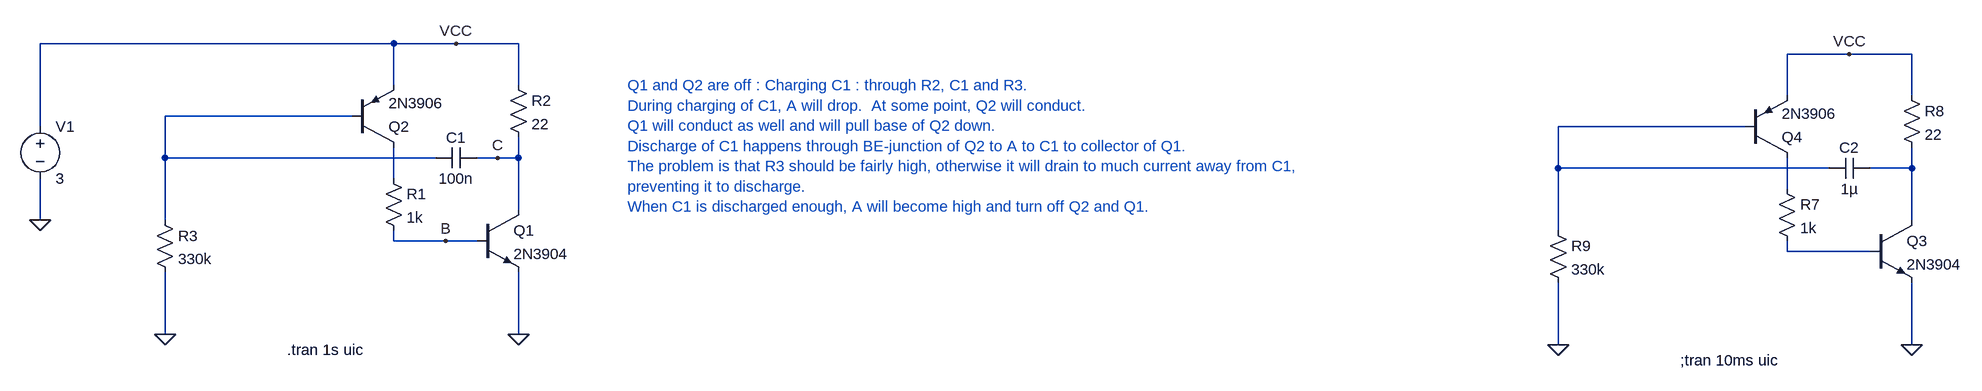
[diagram p0: schematic NPN-PNP.asc]
NPN-PNP.asc, the LTspice schematic file:
Version 4
SHEET 1 2424 680
WIRE 0 -176 -544 -176
WIRE 96 -176 0 -176
WIRE 192 -176 96 -176
WIRE 2240 -160 2144 -160
WIRE 2336 -160 2240 -160
WIRE 0 -112 0 -176
WIRE 192 -112 192 -176
WIRE 2144 -96 2144 -160
WIRE 2336 -96 2336 -160
WIRE -64 -64 -352 -64
WIRE -544 -48 -544 -176
WIRE 2080 -48 1792 -48
WIRE -352 0 -352 -64
WIRE 64 0 -352 0
WIRE 160 0 128 0
WIRE 192 0 192 -32
WIRE 192 0 160 0
WIRE 1792 16 1792 -48
WIRE 2208 16 1792 16
WIRE 2336 16 2336 -16
WIRE 2336 16 2272 16
WIRE 0 32 0 -16
WIRE 2144 48 2144 0
WIRE 192 80 192 0
WIRE -544 96 -544 32
WIRE -352 96 -352 0
WIRE 2336 96 2336 16
WIRE 1792 112 1792 16
WIRE 0 128 0 112
WIRE 80 128 0 128
WIRE 128 128 80 128
WIRE 2144 144 2144 128
WIRE 2272 144 2144 144
WIRE -352 272 -352 176
WIRE 192 272 192 176
WIRE 1792 288 1792 192
WIRE 2336 288 2336 192
FLAG -352 272 0
FLAG 192 272 0
FLAG 96 -176 VCC
FLAG -544 96 0
FLAG 80 128 B
FLAG 160 0 C
FLAG 1792 288 0
FLAG 2336 288 0
FLAG 2240 -160 VCC
SYMBOL npn 128 80 R0
SYMATTR InstName Q1
SYMATTR Value 2N3904
SYMBOL pnp -64 -16 M180
SYMATTR InstName Q2
SYMATTR Value 2N3906
SYMBOL res -16 16 R0
SYMATTR InstName R1
SYMATTR Value 1k
SYMBOL res 176 -128 R0
SYMATTR InstName R2
SYMATTR Value 22
SYMBOL res -368 80 R0
SYMATTR InstName R3
SYMATTR Value 330k
SYMBOL cap 128 -16 R90
WINDOW 0 0 32 VBottom 2
WINDOW 3 32 32 VTop 2
SYMATTR InstName C1
SYMATTR Value 100n
SYMBOL voltage -544 -64 R0
WINDOW 123 0 0 Left 0
WINDOW 39 0 0 Left 0
SYMATTR InstName V1
SYMATTR Value 3
SYMBOL npn 2272 96 R0
SYMATTR InstName Q3
SYMATTR Value 2N3904
SYMBOL pnp 2080 0 M180
SYMATTR InstName Q4
SYMATTR Value 2N3906
SYMBOL res 2128 32 R0
SYMATTR InstName R7
SYMATTR Value 1k
SYMBOL res 2320 -112 R0
SYMATTR InstName R8
SYMATTR Value 22
SYMBOL res 1776 96 R0
SYMATTR InstName R9
SYMATTR Value 330k
SYMBOL cap 2272 0 R90
WINDOW 0 0 32 VBottom 2
WINDOW 3 32 32 VTop 2
SYMATTR InstName C2
SYMATTR Value 1µ
TEXT -164 296 Left 2 !.tran 1s uic
TEXT 360 -112 Left 2 ;Q1 and Q2 are off : Charging C1 : through R2, C1 and R3.\nDuring charging of C1, A will drop.  At some point, Q2 will conduct.\nQ1 will conduct as well and will pull base of Q2 down.\nDischarge of C1 happens through BE-junction of Q2 to A to C1 to collector of Q1.\nThe problem is that R3 should be fairly high, otherwise it will drain to much current away from C1,\npreventing it to discharge.\nWhen C1 is discharged enough, A will become high and turn off Q2 and Q1.
TEXT 1980 312 Left 2 !;tran 10ms uic

The netlist it stands for:
* NPN-PNP.asc
Q1 C B 0 0 2N3904
Q2 N004 N001 VCC 0 2N3906
R1 N004 B 1k
R2 VCC C 22
R3 N001 0 330k
C1 C N001 100n
V1 VCC 0 3
Q3 N003 N006 0 0 2N3904
Q4 N005 N002 VCC 0 2N3906
R7 N005 N006 1k
R8 VCC N003 22
R9 N002 0 330k
C2 N003 N002 1µ
.model NPN NPN
.model PNP PNP
.lib standard.bjt
.tran 1s uic
* Q1 and Q2 are off : Charging C1 : through R2, C1 and R3.
* During charging of C1, A will drop.  At some point, Q2 will conduct.
* Q1 will conduct as well and will pull base of Q2 down.
* Discharge of C1 happens through BE-junction of Q2 to A to C1 to collector of Q1.
* The problem is that R3 should be fairly high, otherwise it will drain to much current away from C1,
* preventing it to discharge.
* When C1 is discharged enough, A will become high and turn off Q2 and Q1.
;tran 10ms uic
.backanno
.end